# EAGLE schematic BoardTemplate (EAGLE 9.1.3)
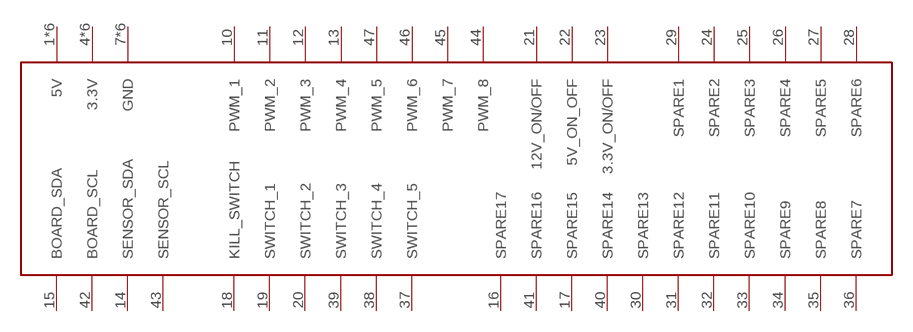
[diagram p0: schematic, sheet 1]

## Parts
U$1  5530843-EDGE  [5530843-6-BOARDFINGERS]
Unconnected: U$1.1(5V) U$1.2(5V) U$1.3(5V) U$1.4(3.3V) U$1.5(3.3V) U$1.6(3.3V) U$1.7(GND) U$1.8(GND) U$1.9(GND) U$1.10(PWM_1) U$1.11(PWM_2) U$1.12(PWM_3) U$1.13(PWM_4) U$1.14(SENSOR_SDA) U$1.15(BOARD_SDA) U$1.16(SPARE17) U$1.17(SPARE15) U$1.18(KILL_SWITCH) U$1.19(SWITCH_1) U$1.20(SWITCH_2) U$1.21(12V_ON/OFF) U$1.22(5V_ON_OFF) U$1.23(3.3V_ON/OFF) U$1.24(SPARE2) U$1.25(SPARE3) U$1.26(SPARE4) U$1.27(SPARE5) U$1.28(SPARE6) U$1.29(SPARE1) U$1.30(SPARE13) U$1.31(SPARE12) U$1.32(SPARE11) U$1.33(SPARE10) U$1.34(SPARE9) U$1.35(SPARE8) U$1.36(SPARE7) U$1.37(SWITCH_5) U$1.38(SWITCH_4) U$1.39(SWITCH_3) U$1.40(SPARE14) U$1.41(SPARE16) U$1.42(BOARD_SCL) U$1.43(SENSOR_SCL) U$1.44(PWM_8) U$1.45(PWM_7) U$1.46(PWM_6) U$1.47(PWM_5) U$1.48(GND) U$1.49(GND) U$1.50(GND) U$1.51(3.3V) U$1.52(3.3V) U$1.53(3.3V) U$1.54(5V) U$1.55(5V) U$1.56(5V)

## Library data of the parts
U$1 = 5530843-6:5530843-EDGE